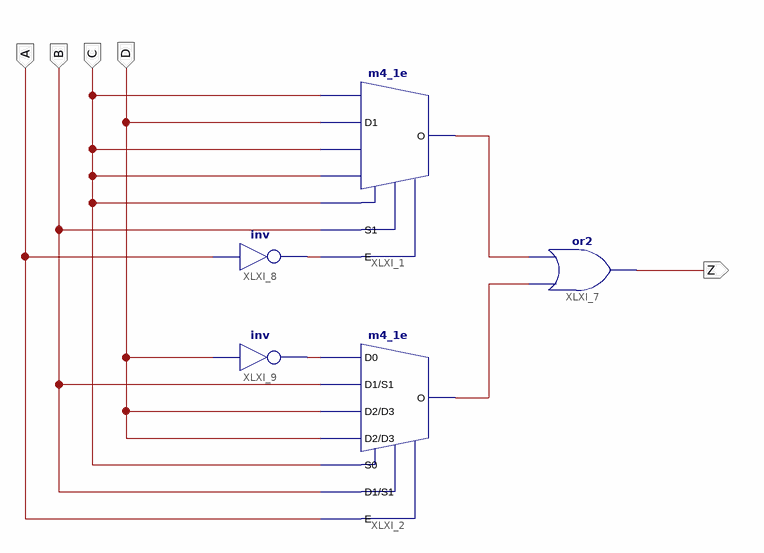
[diagram p0: schematic sheet 1]
// Xilinx ISE schematic p2ej1b.sch (spartan3) as structural Verilog: 5 symbols, 5 ports
module p2ej1b (
  input  A,
  input  B,
  input  C,
  input  D,
  output Z
);

  wire XLXN_19, XLXN_20, XLXN_21, XLXN_33;

  m4_1e XLXI_1 (.D0(C), .D1(D), .D2(C), .D3(C), .E(XLXN_21), .S0(C), .S1(B), .O(XLXN_19));
  m4_1e XLXI_2 (.D0(XLXN_33), .D1(B), .D2(D), .D3(D), .E(A), .S0(C), .S1(B), .O(XLXN_20));
  or XLXI_7 (Z, XLXN_20, XLXN_19);
  not XLXI_8 (XLXN_21, A);
  not XLXI_9 (XLXN_33, D);
endmodule
